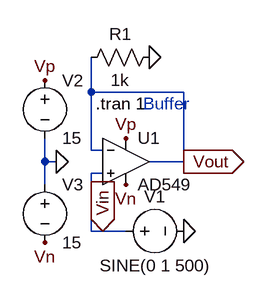
[diagram p0: schematic sch.asc]
sch.asc, the LTspice schematic file:
Version 4
SHEET 1 880 680
WIRE 176 96 176 48
WIRE 304 96 176 96
WIRE 176 176 176 96
WIRE 192 176 176 176
WIRE 112 192 112 160
WIRE 128 192 112 192
WIRE 304 192 304 96
WIRE 304 192 256 192
WIRE 192 208 176 208
WIRE 112 224 112 192
WIRE 176 288 176 208
WIRE 192 288 176 288
WIRE 224 288 192 288
FLAG 256 48 0
FLAG 304 288 0
FLAG 192 288 Vin
IOPIN 192 288 In
FLAG 304 192 Vout
IOPIN 304 192 Out
FLAG 128 192 0
FLAG 112 80 Vp
FLAG 224 160 Vp
FLAG 112 304 Vn
FLAG 224 224 Vn
SYMBOL OpAmps\\AD549 224 128 R0
SYMATTR InstName U1
SYMBOL res 160 64 R270
WINDOW 0 32 56 VTop 2
WINDOW 3 0 56 VBottom 2
SYMATTR InstName R1
SYMATTR Value 1k
SYMBOL voltage 208 288 R270
WINDOW 0 32 56 VTop 2
WINDOW 3 -32 56 VBottom 2
WINDOW 123 0 0 Left 0
WINDOW 39 0 0 Left 0
SYMATTR InstName V1
SYMATTR Value SINE(0 1 500)
SYMBOL voltage 112 64 R0
WINDOW 123 0 0 Left 0
WINDOW 39 0 0 Left 0
SYMATTR InstName V2
SYMATTR Value 15
SYMBOL voltage 112 208 R0
WINDOW 123 0 0 Left 0
WINDOW 39 0 0 Left 0
SYMATTR InstName V3
SYMATTR Value 15
TEXT 248 112 Left 2 ;Buffer
TEXT 182 112 Left 2 !.tran 1

The netlist it stands for:
* sch.asc
XU1 Vin Vout Vp Vn Vout AD549  ; pins In+ In- V+ V- OUT
R1 Vout 0 1k
V1 Vin 0 SINE(0 1 500)
V2 Vp 0 15
V3 0 Vn 15
* Buffer
.tran 1
.backanno
.end